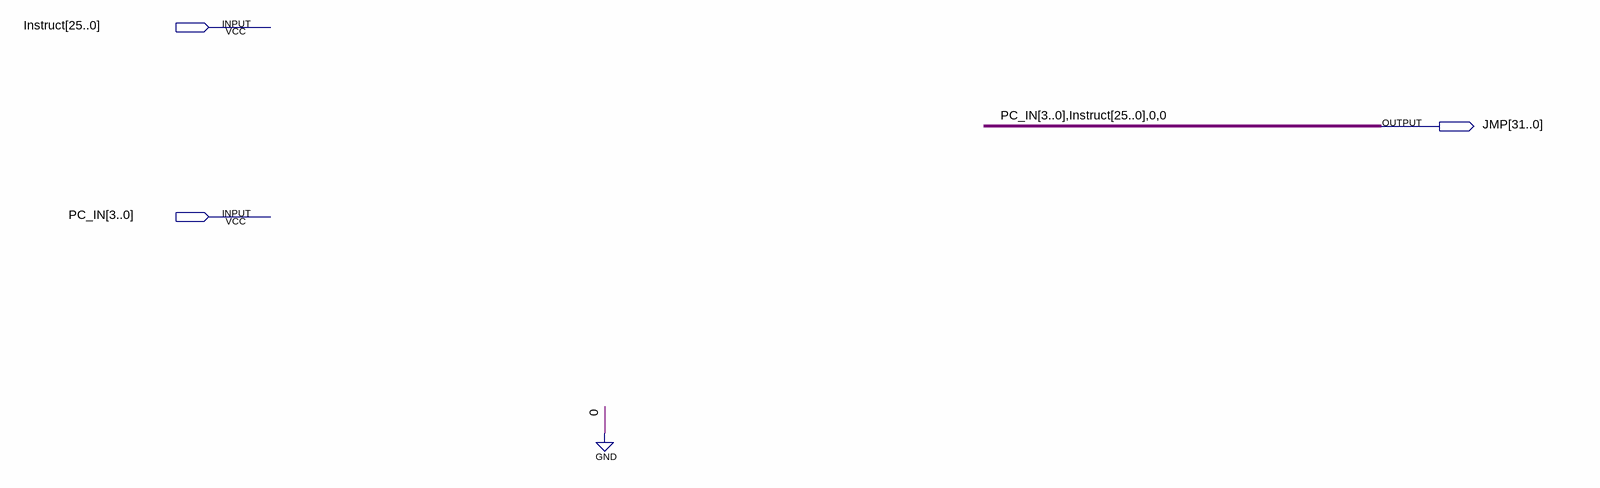
[diagram p0: schematic sheet]
// Quartus schematic JumpAddr.bdf as structural Verilog: 0 symbols, 3 pins
module JumpAddr (
  input  [25:0] Instruct,
  input  [3:0] PC_IN,
  output [31:0] JMP
);


  assign JMP = {PC_IN, Instruct, 2'b00};
endmodule
